# EasyEDA schematic SCH_LeftHalf_2022-04-16.json
TITLE: LeftHalf; REV: 1.0; Date: 2022-04-03; Sheet: 1/1; Drawn By: 羊RZ; Company: Your Company
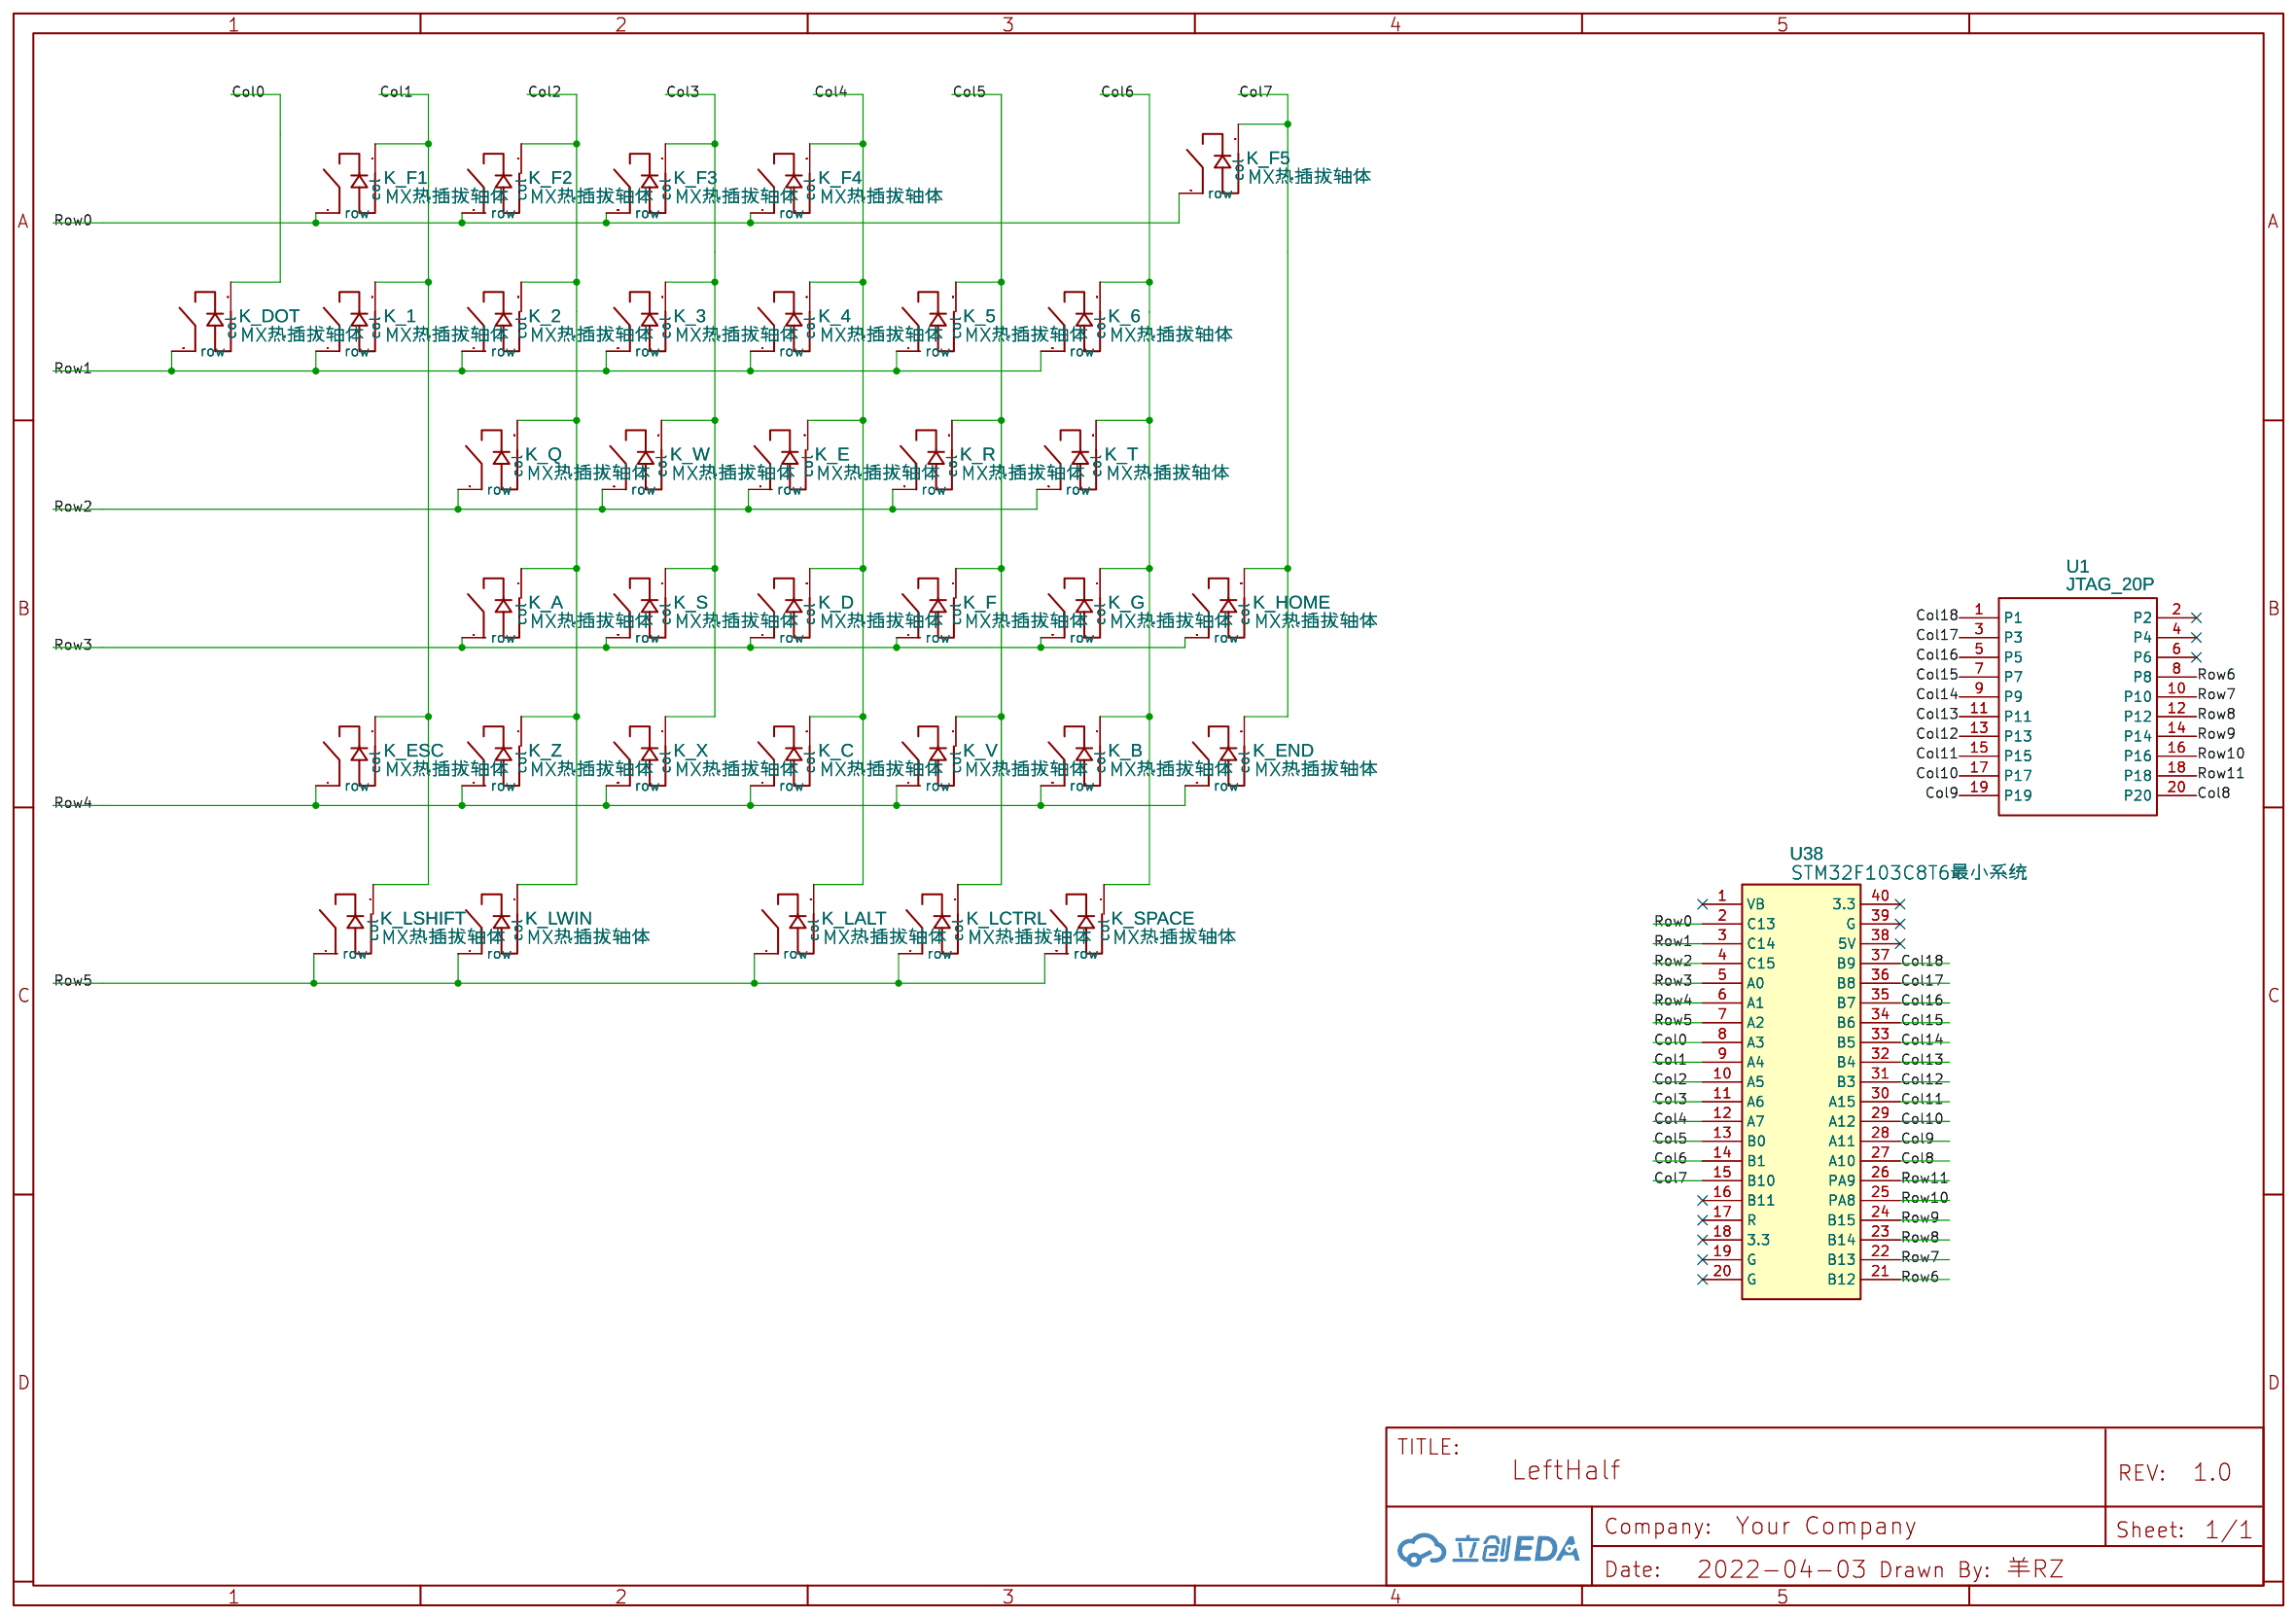
[diagram p0: schematic sheet]

## Parts
K_1  MX热插拔轴体  [凯华热插拔+1N4148]
K_2  MX热插拔轴体  [凯华热插拔+1N4148]
K_3  MX热插拔轴体  [凯华热插拔+1N4148]
K_4  MX热插拔轴体  [凯华热插拔+1N4148]
K_5  MX热插拔轴体  [凯华热插拔+1N4148]
K_6  MX热插拔轴体  [凯华热插拔+1N4148]
K_A  MX热插拔轴体  [凯华热插拔+1N4148]
K_B  MX热插拔轴体  [凯华热插拔+1N4148]
K_C  MX热插拔轴体  [凯华热插拔+1N4148]
K_D  MX热插拔轴体  [凯华热插拔+1N4148]
K_DOT  MX热插拔轴体  [凯华热插拔+1N4148]
K_E  MX热插拔轴体  [凯华热插拔+1N4148]
K_END  MX热插拔轴体  [凯华热插拔+1N4148]
K_ESC  MX热插拔轴体  [凯华热插拔+1N4148]
K_F  MX热插拔轴体  [凯华热插拔+1N4148]
K_F1  MX热插拔轴体  [凯华热插拔+1N4148]
K_F2  MX热插拔轴体  [凯华热插拔+1N4148]
K_F3  MX热插拔轴体  [凯华热插拔+1N4148]
K_F4  MX热插拔轴体  [凯华热插拔+1N4148]
K_F5  MX热插拔轴体  [凯华热插拔+1N4148]
K_G  MX热插拔轴体  [凯华热插拔+1N4148]
K_HOME  MX热插拔轴体  [凯华热插拔+1N4148]
K_LALT  MX热插拔轴体  [凯华热插拔+1N4148]
K_LCTRL  MX热插拔轴体  [凯华热插拔+1N4148]
K_LSHIFT  MX热插拔轴体  [凯华热插拔+1N4148]
K_LWIN  MX热插拔轴体  [凯华热插拔+1N4148]
K_Q  MX热插拔轴体  [凯华热插拔+1N4148]
K_R  MX热插拔轴体  [凯华热插拔+1N4148]
K_S  MX热插拔轴体  [凯华热插拔+1N4148]
K_SPACE  MX热插拔轴体  [凯华热插拔+1N4148]
K_T  MX热插拔轴体  [凯华热插拔+1N4148]
K_V  MX热插拔轴体  [凯华热插拔+1N4148]
K_W  MX热插拔轴体  [凯华热插拔+1N4148]
K_X  MX热插拔轴体  [凯华热插拔+1N4148]
K_Z  MX热插拔轴体  [凯华热插拔+1N4148]
U1  JTAG_20P  [JTAG-20PIN-2.54MM-PTH]
U38  STM32F103C8T6最小系统  [STM32F103C8T6核心板]

## Library data of the parts
K_1-K_6 K_A K_B K_C K_D K_DOT K_E K_END K_ESC K_F K_F1-K_F5 K_G K_HOME K_LALT K_LCTRL K_LSHIFT K_LWIN K_Q K_R K_S K_SPACE K_T K_V K_W K_X K_Z = MX热插拔轴体: Contributor: youngfar
U1 = JTAG_20P: Contributor: phtcnt_yan
U38 = STM32F103C8T6最小系统: Manufacturer Part: New SchematicLib; Contributor: 393803A

## Nets
Col0: K_DOT.COL(col) U38.8(A3)
Col1: K_1.COL(col) K_ESC.COL(col) K_F1.COL(col) K_LSHIFT.COL(col) U38.9(A4)
Col2: K_2.COL(col) K_A.COL(col) K_F2.COL(col) K_LWIN.COL(col) K_Q.COL(col) K_Z.COL(col) U38.10(A5)
Col3: K_3.COL(col) K_F3.COL(col) K_S.COL(col) K_W.COL(col) K_X.COL(col) U38.11(A6)
Col4: K_4.COL(col) K_C.COL(col) K_D.COL(col) K_E.COL(col) K_F4.COL(col) K_LALT.COL(col) U38.12(A7)
Col5: K_5.COL(col) K_F.COL(col) K_LCTRL.COL(col) K_R.COL(col) K_V.COL(col) U38.13(B0)
Col6: K_6.COL(col) K_B.COL(col) K_G.COL(col) K_SPACE.COL(col) K_T.COL(col) U38.14(B1)
Col7: K_END.COL(col) K_F5.COL(col) K_HOME.COL(col) U38.15(B10)
Col8: U1.20(P20) U38.27(A10)
Col9: U1.19(P19) U38.28(A11)
Col10: U1.17(P17) U38.29(A12)
Col11: U1.15(P15) U38.30(A15)
Col12: U1.13(P13) U38.31(B3)
Col13: U1.11(P11) U38.32(B4)
Col14: U1.9(P9) U38.33(B5)
Col15: U1.7(P7) U38.34(B6)
Col16: U1.5(P5) U38.35(B7)
Col17: U1.3(P3) U38.36(B8)
Col18: U1.1(P1) U38.37(B9)
Row0: K_F1.ROW(row) K_F2.ROW(row) K_F3.ROW(row) K_F4.ROW(row) K_F5.ROW(row) U38.2(C13)
Row1: K_1.ROW(row) K_2.ROW(row) K_3.ROW(row) K_4.ROW(row) K_5.ROW(row) K_6.ROW(row) K_DOT.ROW(row) U38.3(C14)
Row2: K_E.ROW(row) K_Q.ROW(row) K_R.ROW(row) K_T.ROW(row) K_W.ROW(row) U38.4(C15)
Row3: K_A.ROW(row) K_D.ROW(row) K_F.ROW(row) K_G.ROW(row) K_HOME.ROW(row) K_S.ROW(row) U38.5(A0)
Row4: K_B.ROW(row) K_C.ROW(row) K_END.ROW(row) K_ESC.ROW(row) K_V.ROW(row) K_X.ROW(row) K_Z.ROW(row) U38.6(A1)
Row5: K_LALT.ROW(row) K_LCTRL.ROW(row) K_LSHIFT.ROW(row) K_LWIN.ROW(row) K_SPACE.ROW(row) U38.7(A2)
Row6: U1.8(P8) U38.21(B12)
Row7: U1.10(P10) U38.22(B13)
Row8: U1.12(P12) U38.23(B14)
Row9: U1.14(P14) U38.24(B15)
Row10: U1.16(P16) U38.25(PA8)
Row11: U1.18(P18) U38.26(PA9)

Not connected (* = marked no-connect by the designer): U1 2(P2)* 4(P4)* 6(P6)*; U38 1(VB)* 16(B11)* 17(R)* 18(3.3)* 19(G)* 20(G)* 38(5V)* 39(G)* 40(3.3)*
